# Altium schematic sheet AMP.SchDoc
size A4
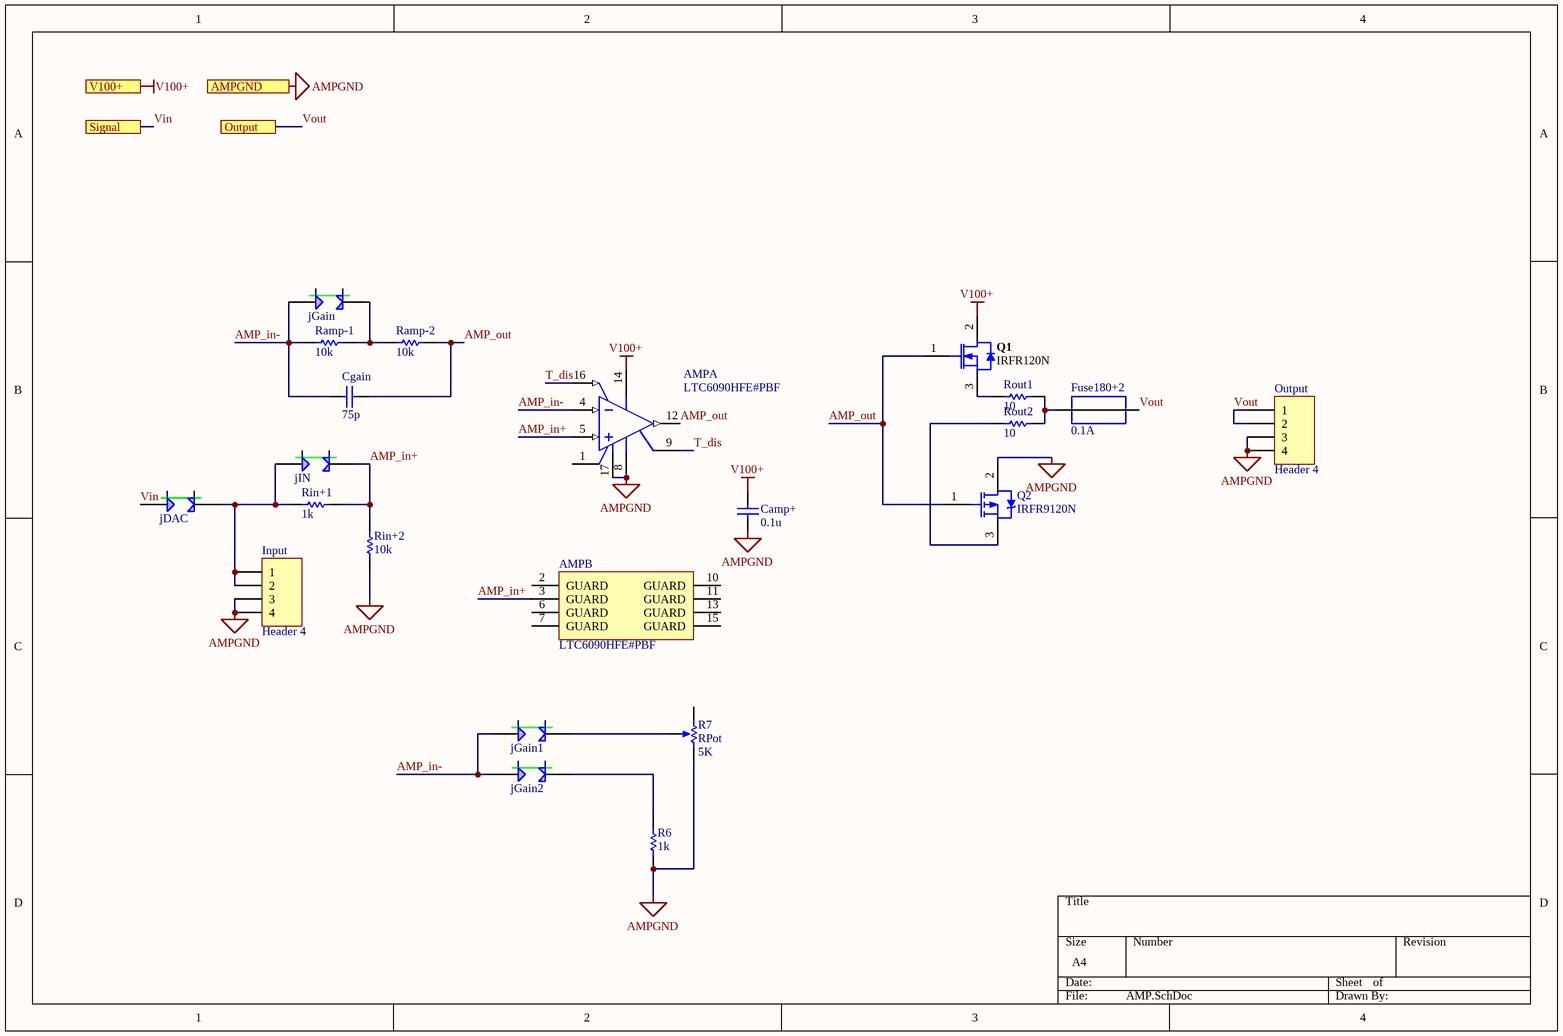
[diagram p0: AMP.SchDoc]

## Parts
AMP  LTC6090HFE#PBF  [LT-FE-16-EPV-BA_N]  (parts A,B of 2)
Camp+  value 0.1u  [C_0805]  (hidden comment: 445-6808-1-ND)
Cgain  value 75p  [AXIAL-0.5]  (hidden comment: ?)
Fuse180+2  value 0.1A  [FuseHolder]  (hidden comment: Fuse)
Input  Header 4  [HDR1X4]
jDAC  Jumper  [HDR1X2]  (value not drawn)
jGain  Jumper  [HDR1X2]  (value not drawn)
jGain1  Jumper  [HDR1X2]  (value not drawn)
jGain2  Jumper  [HDR1X2]  (value not drawn)
jIN  Jumper  [HDR1X2]  (value not drawn)
Output  Header 4  [HDR1X4]
Q1  IRFR120N  [INF-PG-TO252]
Q2  IRFR9120N  [INF-PG-TO252]
R6  value 1k  [0805]  (hidden comment: ?)
R7  RPot  value 5K  [VR5]
Ramp-1  value 10k  [AXIAL-0.5]  (hidden comment: ?)
Ramp-2  value 10k  [AXIAL-0.5]  (hidden comment: ?)
Rin+1  value 1k  [0805]  (hidden comment: ?)
Rin+2  value 10k  [0805]  (hidden comment: ?)
Rout1  value 10  [Res_5w]  (hidden comment: ?)
Rout2  value 10  [Res_5w]  (hidden comment: ?)

## Ports
AMPGND, Output, Signal, V100+

## Nets
AMPGND: AMP.8(V-) AMP.17(EP) Camp+.1 Input.3 Input.4 Output.3 Output.4 Q2.2(DRAIN) R6.1 R7.2(BOT) Rin+2.1 ; port AMPGND
V100+: AMP.14(V+) Camp+.2 Q1.2(DRAIN) ; port V100+
AMP_in+: AMP.3(GUARD) AMP.5(+IN) jIN.2 Rin+1.2 Rin+2.2
AMP_in-: AMP.4(-IN) Cgain.1 jGain.1 jGain1.1 jGain2.1 Ramp-1.1
AMP_out: AMP.12(OUT) Cgain.2 Q1.1(GATE) Q2.1(GATE) Ramp-2.2
T_dis: AMP.9(~{TFLAG}) AMP.16(~{OD})
Vin: jDAC.1 ; port Signal
Vout: Fuse180+2.2 Output.1 Output.2 ; port Output
NetFuse180+2_1: Fuse180+2.1 Rout1.2 Rout2.2
NetInput_1: Input.1 Input.2 jDAC.2 jIN.1 Rin+1.1
NetjGain1_2: jGain1.2 R7.3(TAP)
NetjGain2_2: jGain2.2 R6.2
NetjGain_2: jGain.2 Ramp-1.2 Ramp-2.1
NetQ1_3: Q1.3(SOURCE) Rout1.1
NetQ2_3: Q2.3(SOURCE) Rout2.1

Not connected (* = marked no-connect by the designer): AMP 1(COM) 2(GUARD) 6(GUARD) 7(GUARD) 10(GUARD) 11(GUARD) 13(GUARD) 15(GUARD); R7 1(TOP)

## Library data of the parts
AMP = LTC6090HFE#PBF: Single Channel, Picoamp Input Current, CMOS Operational Amplifier, RRO, 10 MHz Typical GBW, 19 V/us Typical SR, 9.5 to 140 V, 16-Pin SOP (FE-16), High Temperature / Automotive, Pb-Free; Manufacturer: Linear Technology; PackageVersion: Rev I; PackageReference: LT-FE-16-EPV-BA; PackageDescription: 16-Lead Plastic TSSOP, Body 5.00 x 4.40 mm, Pitch 0.65 mm; Supplier 1: Digi-Key; Supplier Part Number 1: LTC6090HFE#PBF-ND; Supplier 2: Farnell; Supplier Part Number 2: 2355214; Supplier 3: Newark; Supplier Part Number 3: 48W6433; Linear Technology Part Number: LTC6090; RoHS: Pb-Free; Mounting Technology: Surface Mount; PartNumber: LTC6090HFE#PBF; ComponentLink1Description: Manufacturer URL; ComponentLink1URL: http://www.linear.com/; ComponentLink2Description: Datasheet; ComponentLink2URL: http://cds.linear.com/docs/en/datasheet/6090f.pdf; ComponentLink3Description: Package Specification; ComponentLink3URL: http://cds.linear.com/docs/en/packaging/05081663_I_FE16%28BA%29.pdf
Camp+ = Csemi: Capacitor (Semiconductor SIM Model); PartNO: 445-6808-1-ND
Cgain = Cfilm: Capacitor (Semiconductor SIM Model); PartNO: ?
Input Output = Header 4: Header, 4-Pin; LatestRevisionDate: 17-Jul-2002; LatestRevisionNote: Re-released for DXP Platform.; Publisher: Altium Limited
jDAC jGain jGain1 jGain2 jIN = Jumper: solderable jumper
Q1 = IRFR120N: N-Channel OptiMOS Small-Signal-Transistor, 60 V VDS, 0.3 A ID, -55 to 150 degC, PG-SOT23, Reel, Green; Manufacturer: Infineon; PartNumber: 2N7002; Green: TRUE; ID (max): 0.3 A; IDpuls (max): 1.2 A; Ptot (max): 0.5 W; QG: 0.4 nC; RDS (on) (max): 3,000 mOhm; RDS (on) (max) (@4.5V): 4,000 mOhm; RthJA (max): 250 K/W; VDS (max): 100 V; VGS(th) (max): 10 V; VGS(th) (min): 1.5 V; DatasheetVersion: Rev. 2.4; PackageVersion: Apr-08; PackageReference: PG-SOT23; PackageDescription: 3-Pin Small Outline Transistor Package, 2.9 x 1.3 mm Body, 0.95 mm Pitch; Halogen-free: TRUE; Packing: Reel; Mounting Technology: Surface Mount; ComponentLink1Description: Manufacturer URL; ComponentLink1URL: http://www.infineon.com/; ComponentLink2Description: Datasheet; ComponentLink2URL: http://www.infineon.com/dgdl/2N7002_Rev2.4.pdf?folderId=db3a3043156fd573011622e10b5c1f67&fileId=db3a304319bc939a0119c2a9461e79e6; ComponentLink3Description: Package Specification; ComponentLink3URL: http://www.infineon.com/dgdl/SOT23-Package_Overview.pdf?folderId=db3a30431936bc4b0119532290053c66&fileId=db3a30431936bc4b0119533468123c85; Supplier 1: Digi-Key; Supplier Part Number 1: IRFR120NPBFTR-ND
Q2 = IRFR9120N: P-Channel OptiMOS P Small-Signal-Transistor, -30 V VDS, -5.5 A ID, -55 to 150 degC, PG-TSOP-6, Reel, Green; Manufacturer: Infineon; PartNumber: BSL307SP; Green: TRUE; ID (max): -5.5 A; IDpuls (max): -22 A; Pto t (max): 2 W; QG: -23.4 nC; RDS (on) (max): 43 mOhm; RDS (on) (max) (@4.5V): 74 mOhm; Rth: 230 K/W; VDS (max): -30 V; VGS(th) (max): -2 V; VGS(th) (min): -1 V; DatasheetVersion: Rev. 1.5; PackageReference: PG-TSOP-6; PackageDescription: 6-Pin Thin Small Outline Package, 2.9 x 1.6 mm Body, 0.95 mm Pitch; Packing: Reel; Polarity: P; Mounting Technology: Surface Mount; ComponentLink1Description: Manufacturer URL; ComponentLink1URL: http://www.infineon.com/; ComponentLink2Description: Datasheet; ComponentLink2URL: http://www.infineon.com/dgdl/BSL307SP_Rev+1.5.pdf?folderId=db3a304412b407950112b408e8c90004&fileId=db3a304412b407950112b42af8304433; ComponentLink3Description: Package Specification; ComponentLink3URL: http://www.infineon.com/cms/packages/SMD_-_Surface_Mounted_Devices/TSOP/TSOP6.html?__locale=en; Supplier 1: Digi-Key; Supplier Part Number 1: IRFR9120NCPBF-ND
R6 Rin+1 Rin+2 Rout1 Rout2 = Rsemi: Semiconductor Resistor, SMD; PartNO: ?
R7 = RPot: Potentiometer; Sim Note: Enter the Resistance value and the set point into parameter fields.; Set Position: 0.5; Published: 8-Jun-2000; LatestRevisionDate: 17-Jul-2002; LatestRevisionNote: Re-released for DXP Platform.; PackageReference: VR5; Publisher: Altium Limited; PackageDescription: Variable Resistor, Thru-Hole; 3 Leads
Ramp-1 Ramp-2 = Rth: Semiconductor Resistor, SMD; PartNO: ?
Fuse180+2 = Fuse: PartNO: ?